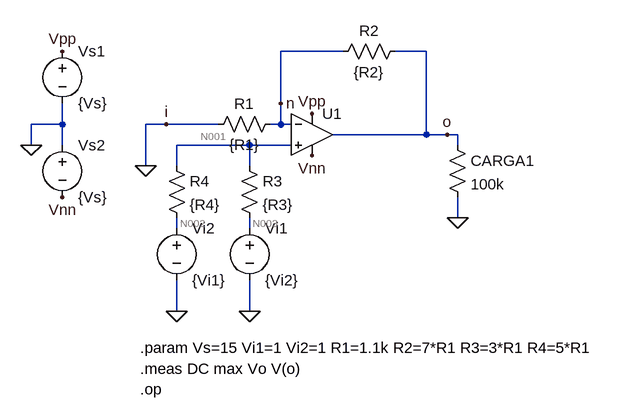
[diagram p0: schematic ex1d.asc]
ex1d.asc, the LTspice schematic file:
Version 4
SHEET 1 880 680
WIRE 112 -32 16 -32
WIRE 240 -32 192 -32
WIRE 16 48 16 -32
WIRE -320 80 -320 48
WIRE -320 80 -368 80
WIRE -160 80 -192 80
WIRE -80 80 -160 80
WIRE 16 80 16 48
WIRE 16 80 0 80
WIRE 32 80 16 80
WIRE 240 96 240 -32
WIRE 240 96 96 96
WIRE 272 96 240 96
WIRE 288 96 272 96
WIRE -368 112 -368 80
WIRE -320 112 -320 80
WIRE -32 112 -144 112
WIRE 32 112 -32 112
WIRE 288 112 288 96
WIRE -192 144 -192 80
WIRE -144 144 -144 112
WIRE -32 144 -32 112
WIRE 288 224 288 192
WIRE -144 240 -144 224
WIRE -32 240 -32 224
WIRE -144 368 -144 320
WIRE -32 368 -32 320
FLAG -32 368 0
FLAG -192 144 0
FLAG 288 224 0
FLAG -368 112 0
FLAG -320 -32 Vpp
FLAG -320 192 Vnn
FLAG 272 96 o
FLAG -160 80 i
FLAG 64 64 Vpp
FLAG 64 128 Vnn
FLAG 16 48 n
FLAG -144 368 0
SYMBOL voltage -32 224 R0
SYMATTR InstName Vi1
SYMATTR Value {Vi2}
SYMBOL res 16 64 R90
WINDOW 0 0 56 VBottom 2
WINDOW 3 32 56 VTop 2
SYMATTR InstName R1
SYMATTR Value {R1}
SYMBOL res 208 -48 R90
WINDOW 0 0 56 VBottom 2
WINDOW 3 32 56 VTop 2
SYMATTR InstName R2
SYMATTR Value {R2}
SYMBOL OpAmps\\UniversalOpAmp2 64 96 R0
SYMATTR InstName U1
SYMATTR Value2 Avol=125 GBW=10Meg Slew=10Meg
SYMBOL voltage -320 -48 R0
SYMATTR InstName Vs1
SYMATTR Value {Vs}
SYMBOL voltage -320 96 R0
SYMATTR InstName Vs2
SYMATTR Value {Vs}
SYMBOL res 272 96 R0
SYMATTR InstName CARGA1
SYMATTR Value 100k
SYMBOL res -48 128 R0
SYMATTR InstName R3
SYMATTR Value {R3}
SYMBOL voltage -144 224 R0
SYMATTR InstName Vi2
SYMATTR Value {Vi1}
SYMBOL res -160 128 R0
SYMATTR InstName R4
SYMATTR Value {R4}
TEXT -200 424 Left 2 !.param Vs=15 Vi1=1 Vi2=1 R1=1.1k R2=7*R1 R3=3*R1 R4=5*R1
TEXT -200 488 Left 2 !.op
TEXT -200 456 Left 2 !.meas DC max Vo V(o)

The netlist it stands for:
* ex1d.asc
Vi1 N003 0 {Vi2}
R1 n 0 {R1}
R2 o n {R2}
XU1 N001 n Vpp Vnn o level2 Avol=125 GBW=10Meg Slew=10Meg Ilimit=25m Rail=0 Vos=0 En=0 Enk=0 In=0 Ink=0 Rin=500Meg  ; pins In+ In- V+ V- OUT
Vs1 Vpp 0 {Vs}
Vs2 0 Vnn {Vs}
R§CARGA1 o 0 100k
R3 N001 N003 {R3}
Vi2 N002 0 {Vi1}
R4 N001 N002 {R4}
.param Vs=15 Vi1=1 Vi2=1 R1=1.1k R2=7*R1 R3=3*R1 R4=5*R1
.op
.meas DC max Vo V(o)
.lib UniversalOpAmp2.lib
.backanno
.end

* Results of the author's LTspice run, read from the files saved beside the schematic
* Operating Point:
*   V(n003) = 1 V
*   V(n) = 936.7 mV
*   V(o) = 7.494 V
*   V(vpp) = 15 V
*   V(vnn) = -15 V
*   V(n001) = 1 V
*   V(n002) = 1 V
*   I(R1) = 851.6 µA
*   I(R2) = 851.6 µA
*   I(Carga1) = 74.94 µA
*   I(R3) = -1.25 nA
*   I(R4) = -750 pA
*   I(Vi1) = -1.25 nA
*   I(Vs1) = -1.841 mA
*   I(Vs2) = -915 µA
*   I(Vi2) = -750 pA
*   Ix(u1:1) = 2 nA
*   Ix(u1:2) = 1.873 nA
*   Ix(u1:3) = 1.841 mA
*   Ix(u1:4) = -915 µA
*   Ix(u1:5) = -926.5 µA
* From the log:
*   Semiconductor Device Operating Points:
*                           --- Diodes ---
*   Name:    d:u1:1      d:u1:2
*   Model:    u1:x        u1:x
*   Id:     -7.51e-12   -2.25e-11
*   Vd:     -7.51e+00   -2.25e+01
*   Req:     1.00e-12    1.00e-12
*   CAP:     0.00e+00    0.00e+00
*   max=0 FROM 1 TO 1